# Altium schematic sheet PAGE2.SCHDOC: Active Tag 433.92 MHz Receiver
size B; DocumentNumber: Crdit Card Size Tag; Revision: 37; SheetNumber: 2; SheetTotal: 2
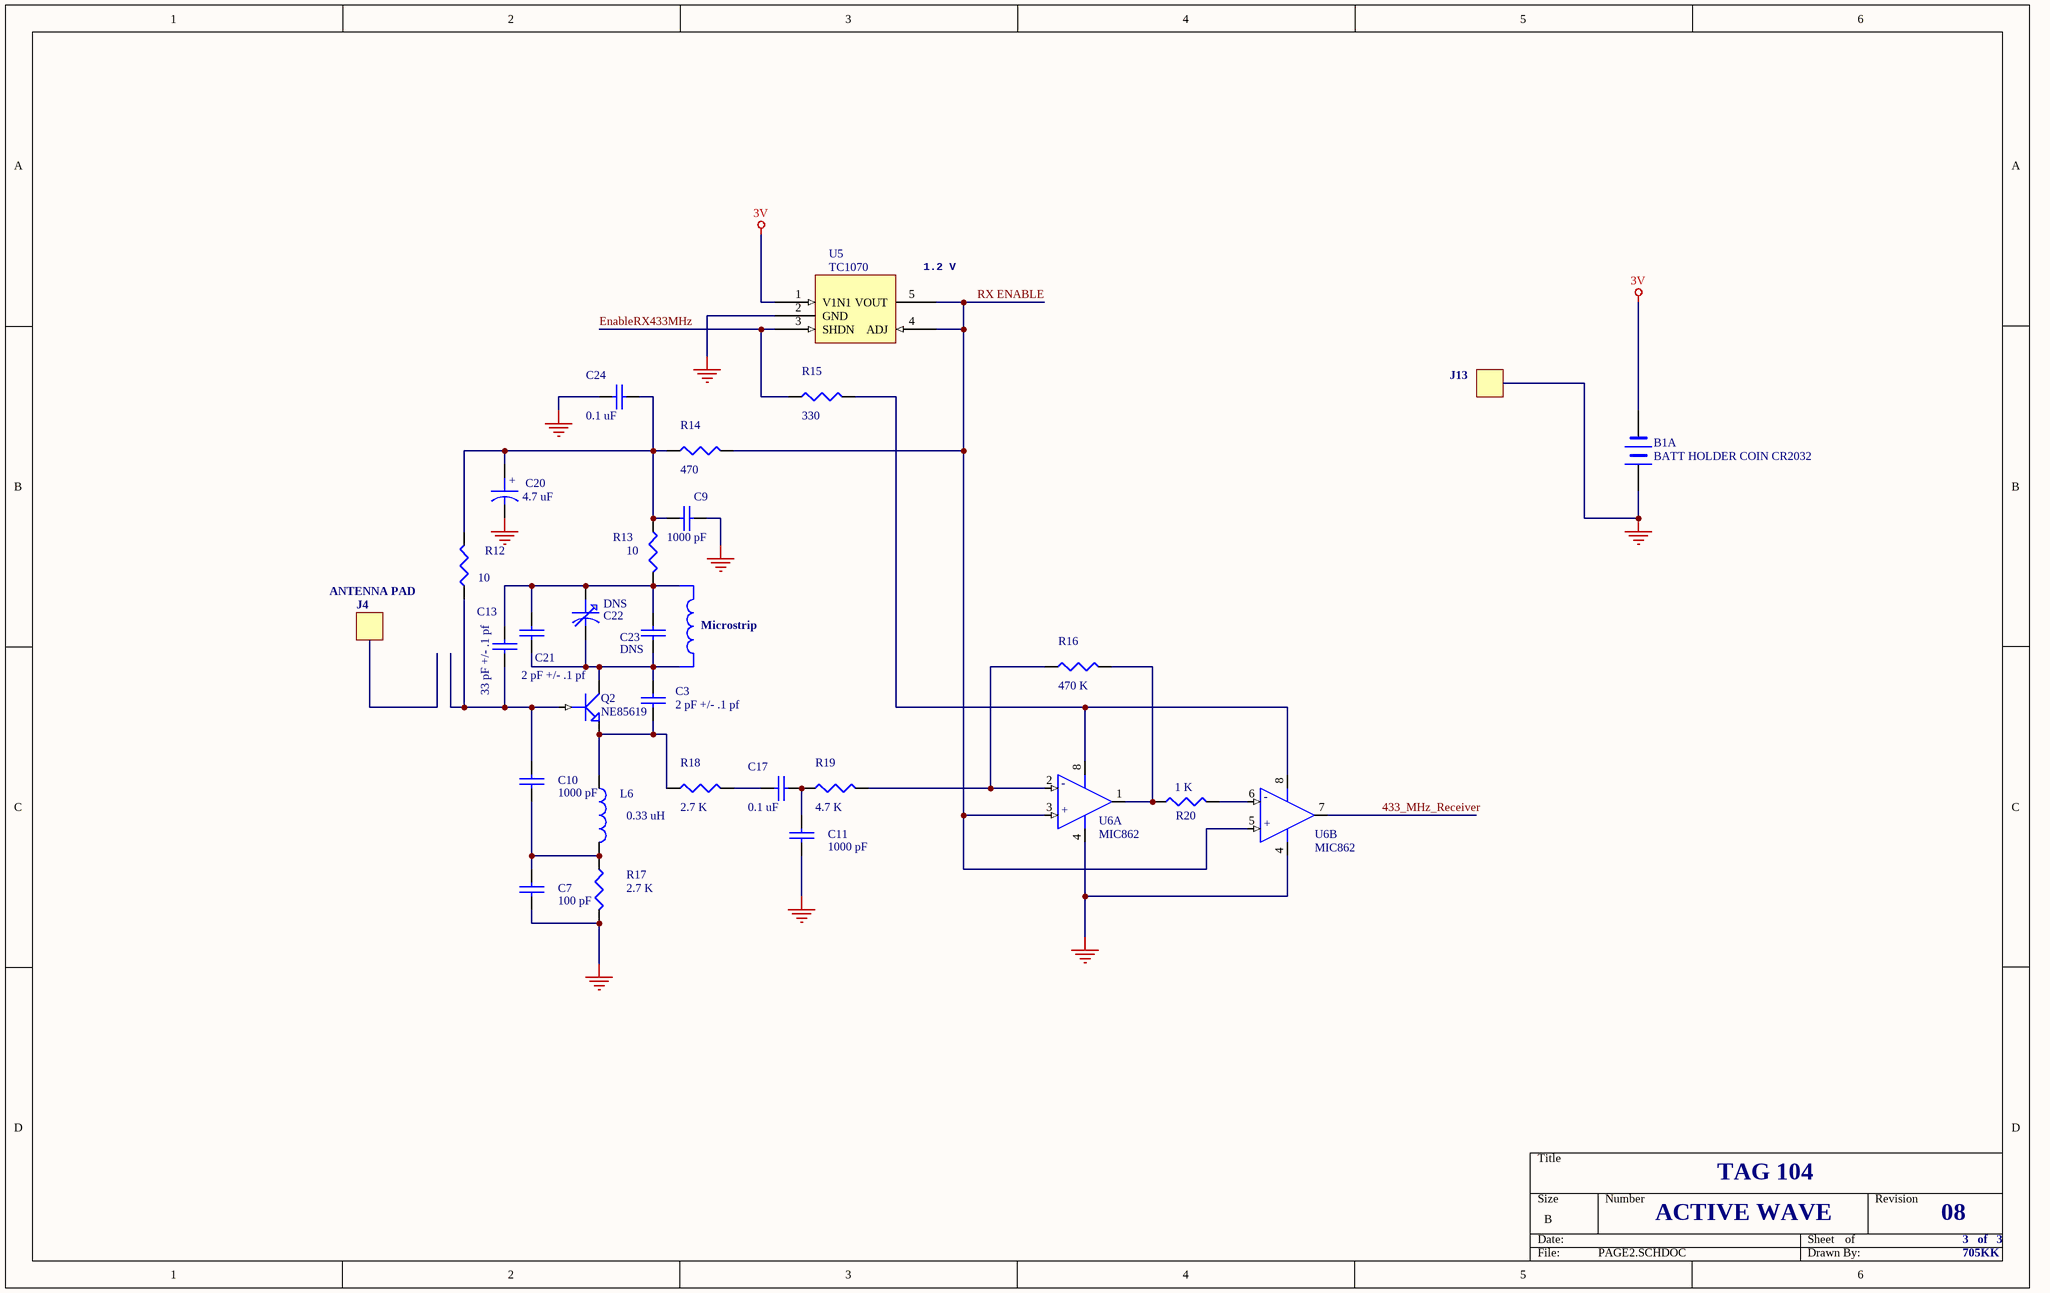
[diagram p0: PAGE2.SCHDOC]

## Parts
B1A  BATT HOLDER COIN CR2032  [BATT HOLDER COIN CR2032]
C3  2 pF +/- .1 pf  [0603]
C7  100 pF  [0603]
C9  1000 pF  [0603]
C10  1000 pF  [0603]
C11  1000 pF  [0603]
C13  33 pF +/- .1 pf  [0603]
C17  0.1 uF  [0603]
C20  4.7 uF  [CAP A CASE]
C21  2 pF +/- .1 pf  [0603]
C22  DNS  [0603]
C23  DNS  [0603]
C24  0.1 uF  [0603]
L6  0.33 uH  [0603]
Q2  NE85619  [3 PIN ULTRA SUPER MINI MOLD]
R12  10  [0603]
R13  10  [0603]
R14  470  [0603]
R15  330  [0603]
R16  470 K  [0603]
R17  2.7 K  [0603]
R18  2.7 K  [0603]
R19  4.7 K  [0603]
R20  1 K  [0603]
U5  TC1070  [SOT23-5A]
U6  MIC862  [SOT23-8]  (parts A,B of 2)

## Nets
3V: B1A.2(-) U5.1(V1N1)
GND_SIGNAL: B1A.1(+) C7.2 C9.2 C11.2 C20.2 C24.1 R17.2 U5.2(GND) U6.4(VSS)
433_MHz_Receiver: U6.7(OUT)
EnableRX433MHz: R15.1 U5.3(SHDN)
RX ENABLE: R14.2 U5.4(ADJ) U5.5(VOUT) U6.3(+) U6.5(+)
NetC3_1: C3.1 C21.2 C22.2 C23.2 Q2.C
NetC3_2: C3.2 L6.1 Q2.E R18.1
NetC7_1: C7.1 C10.2 L6.2 R17.1
NetC9_1: C9.1 C20.1 C24.2 R12.2 R13.1 R14.1
NetC10_1: C10.1 C13.1 Q2.B R12.1
NetC11_1: C11.1 C17.2 R19.1
NetC13_2: C13.2 C21.1 C22.1 C23.1 R13.2
NetC17_1: C17.1 R18.2
NetR15_2: R15.2 U6.8(VDD)
NetR16_1: R16.1 R19.2 U6.2(-)
NetR16_2: R16.2 R20.1 U6.1(OUT)
NetR20_2: R20.2 U6.6(-)

## Notes on the sheet
- (near U5) 1.2 V
- J13
- ANTENNA PAD
- J4
- Microstrip
- TAG 104
- ACTIVE WAVE
- 08
- 3   of   3
- 705KK
- (in symbol CAPACITOR POL/SM) +

## Library data of the parts
B1A = BATTERY
C3 C7 C9-C11 C13 C17 C21 C23 C24 = CAP: Capacitor
C20 = CAPACITOR POL/SM: Text Field1: 20; Text Field2: 20
C22 = CAPACITOR VAR: Text Field1: 20; Text Field2: 20
L6 = INDUCTOR: Text Field1: 20; Text Field2: 40
Q2 = NPN1: NPN Transistor
R12-R16 R18-R20 = R: Text Field1: 20; Text Field2: 30
R17 = RESISTOR: Text Field1: 20; Text Field2: 30
U5 = TC1070-2: Text Field1: 60; Text Field2: 50
U6 = MIC862: Text Field1: 40; Text Field2: 40